# Altium schematic sheet Rpi_GPIO.SchDoc
size A4
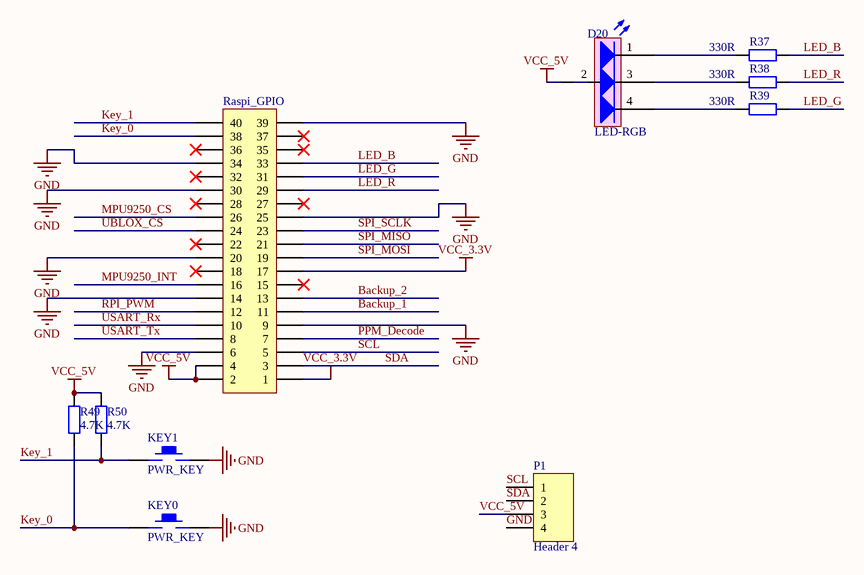
[diagram p0: Rpi_GPIO.SchDoc]

## Parts
D20  LED-RGB  [LED_5050_RGB]
KEY0  PWR_KEY  [KEY_M]
KEY1  PWR_KEY  [KEY_M]
P1  Header 4  [HDR1X4]
R37  value 330R  [0805]  (hidden comment: Res2)
R38  value 330R  [0805]  (hidden comment: Res2)
R39  value 330R  [0805]  (hidden comment: Res2)
R49  value 4.7K  [0805]  (hidden comment: Res2)
R50  value 4.7K  [0805]  (hidden comment: Res2)
Raspi_GPIO  Header 20X2  [HDR2X20]  (value not drawn)

## Nets
GND: KEY0.2 KEY1.2 P1.4 Raspi_GPIO.6 Raspi_GPIO.9 Raspi_GPIO.14 Raspi_GPIO.20 Raspi_GPIO.25 Raspi_GPIO.30 Raspi_GPIO.34 Raspi_GPIO.39
VCC_3.3V: Raspi_GPIO.1 Raspi_GPIO.17
VCC_5V: D20.2(A) P1.3 R49.1 R50.1 Raspi_GPIO.2 Raspi_GPIO.4
Backup_1: Raspi_GPIO.11
Backup_2: Raspi_GPIO.13
Key_0: KEY0.1 R49.2 Raspi_GPIO.38
Key_1: KEY1.1 R50.2 Raspi_GPIO.40
LED_B: R37.1 Raspi_GPIO.33
LED_G: R39.1 Raspi_GPIO.31
LED_R: R38.1 Raspi_GPIO.29
MPU9250_CS: Raspi_GPIO.26
MPU9250_INT: Raspi_GPIO.16
PPM_Decode: Raspi_GPIO.7
RPI_PWM: Raspi_GPIO.12
SCL: P1.1 Raspi_GPIO.5
SDA: P1.2 Raspi_GPIO.3
SPI_MISO: Raspi_GPIO.21
SPI_MOSI: Raspi_GPIO.19
SPI_SCLK: Raspi_GPIO.23
UBLOX_CS: Raspi_GPIO.24
USART_Rx: Raspi_GPIO.10
USART_Tx: Raspi_GPIO.8
NetD20_1: D20.1(R) R37.2
NetD20_3: D20.3(G) R38.2
NetD20_4: D20.4(B) R39.2

Not connected (* = marked no-connect by the designer): Raspi_GPIO 15* 18* 22* 27* 28* 32* 35* 36* 37*

## Library data of the parts
D20 = LED-RGB: 三基色LED; pin to pad: 1>K1 2>A 3>K2 4>K3; Published: 8-Jun-2000; LatestRevisionDate: 08-Jul-2005; LatestRevisionNote: Mech Layer 1 removed.; PackageReference: LED-0; Publisher: Altium Limited
KEY0 KEY1 = KEY_M
P1 = Header 4: Header, 4-Pin; LatestRevisionDate: 17-Jul-2002; LatestRevisionNote: Re-released for DXP Platform.; Publisher: Altium Limited
R37-R39 R49 R50 = Res2: Resistor; Published: 8-Jun-2000; LatestRevisionDate: 17-Jul-2002; LatestRevisionNote: Re-released for DXP Platform.; PackageReference: AXIAL-0.4; Publisher: Altium Limited; PackageDescription: Axial Device, Thru-Hole; 2 Leads; 0.4 in Pin Spacing
Raspi_GPIO = Header 20X2: Header, 20-Pin, Dual row; LatestRevisionDate: 17-Jul-2002; LatestRevisionNote: Re-released for DXP Platform.; Publisher: Altium Limited